# Altium schematic sheet FOC_Mode_V1.SchDoc
size A3; SheetNumber: 1; SheetTotal: 1
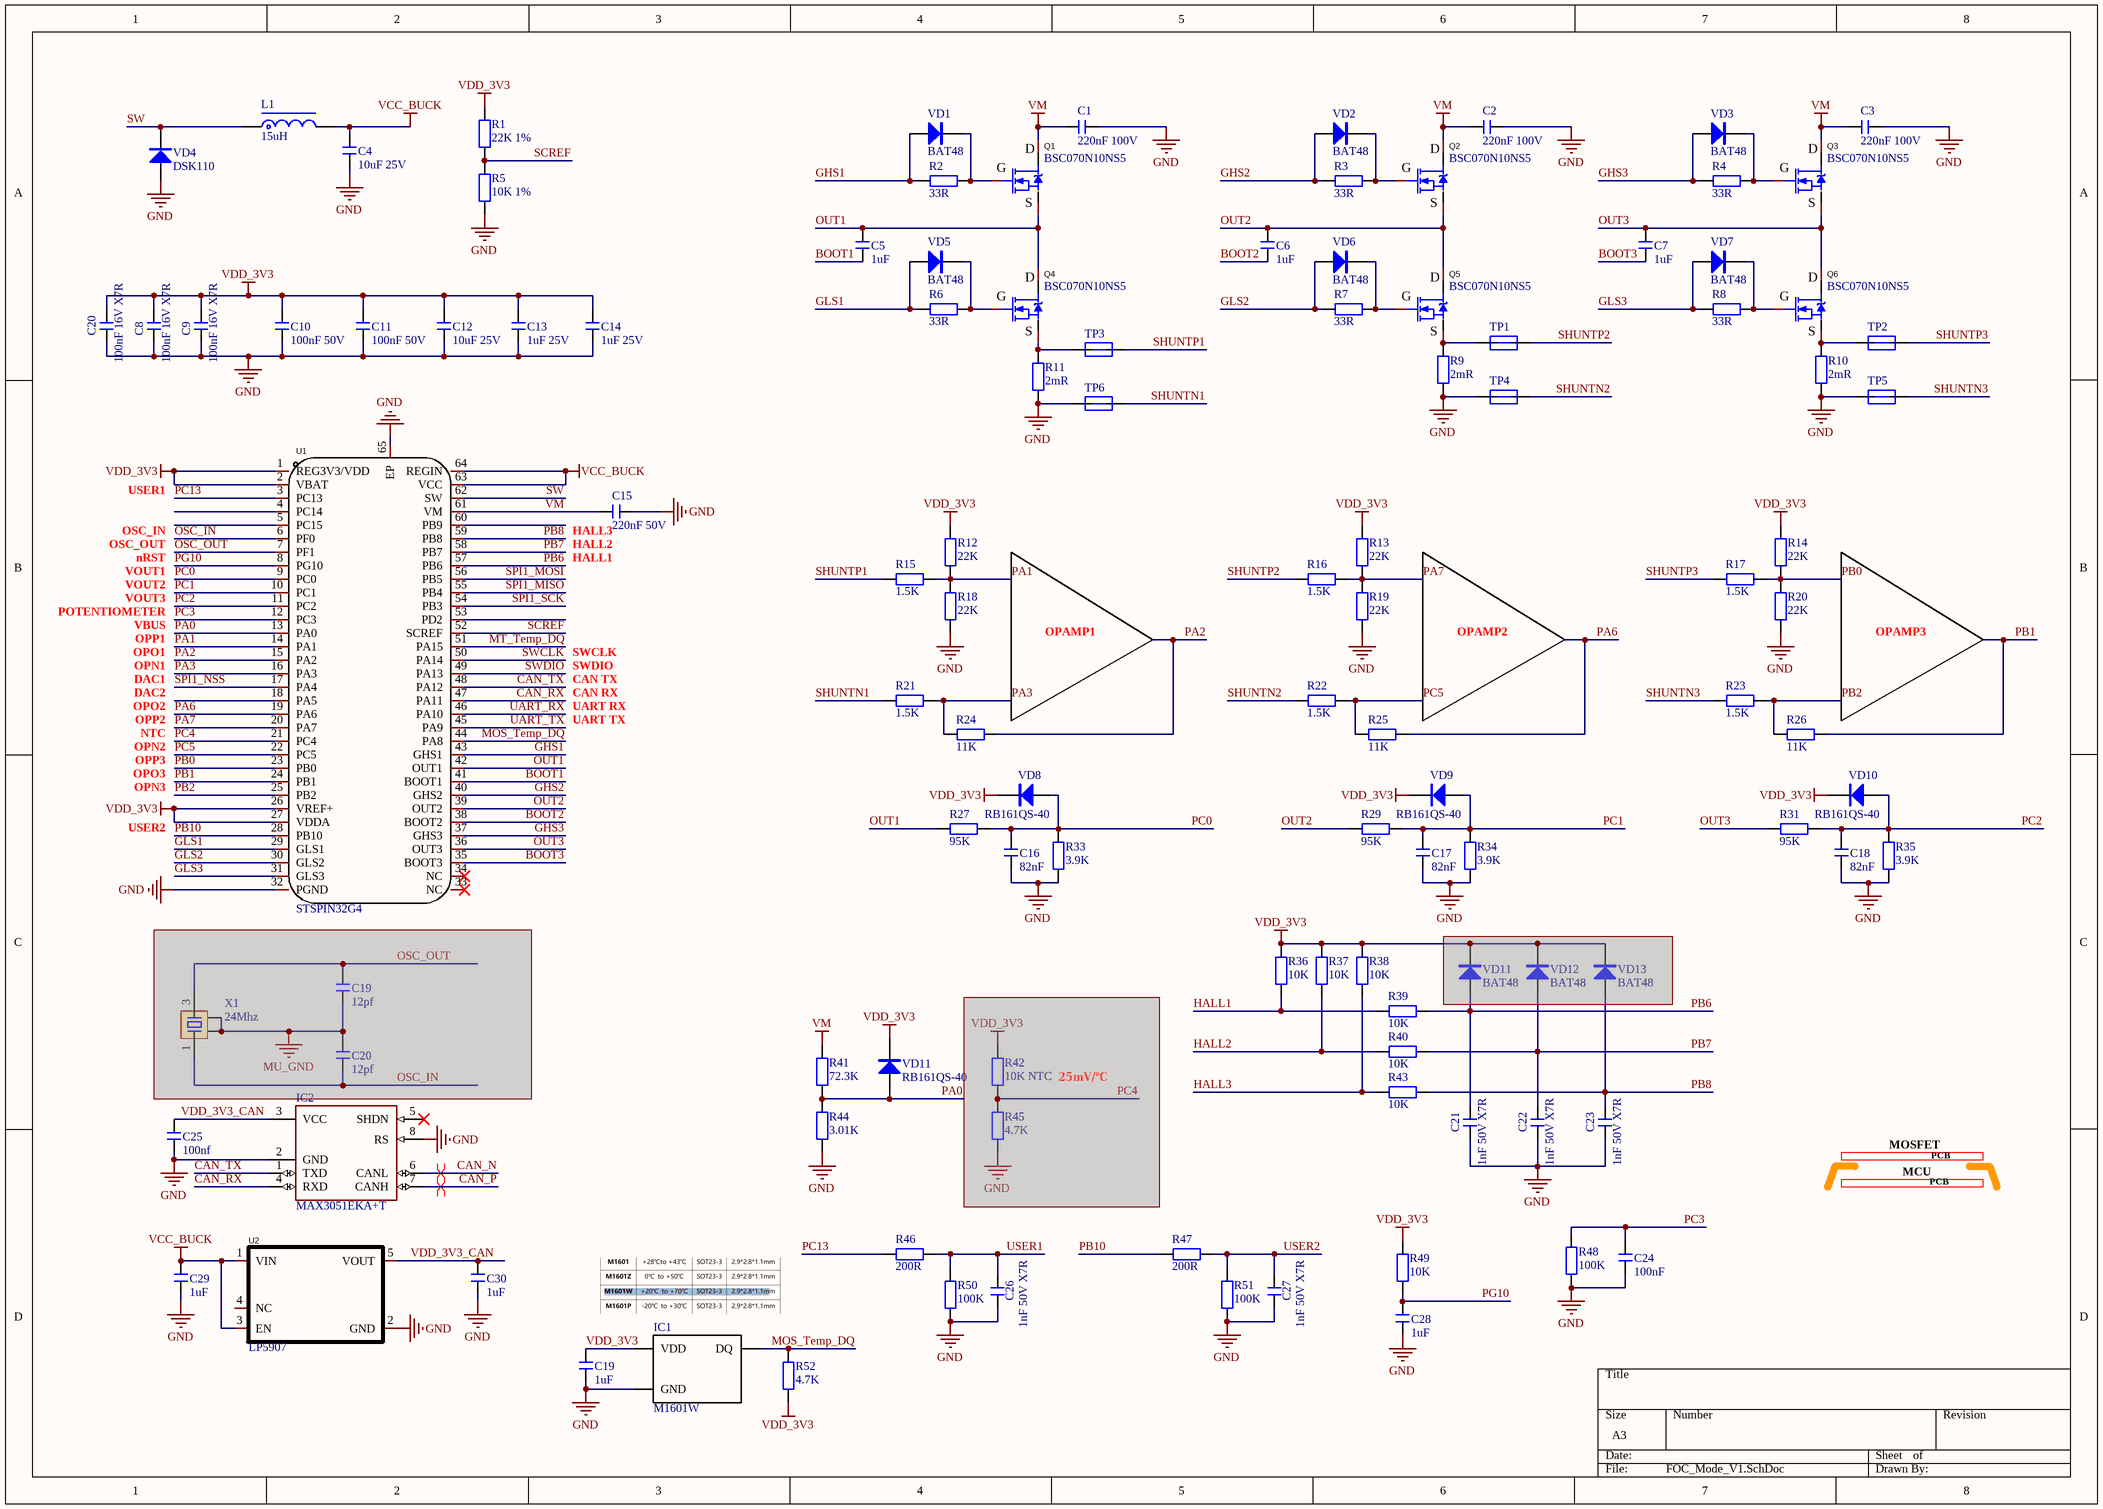
[diagram p0: FOC_Mode_V1.SchDoc]

## Parts
(Parts that share a designator on the sheet are numbered #1, #2 ... from top to bottom, then left to right.)
C1  220nF 100V  [C 0805]
C2  220nF 100V  [C 0805]
C3  220nF 100V  [C 0805]
C4  10uF 25V  [C 1206]
C5  1uF  [C 0805]
C6  1uF  [C 0805]
C7  1uF  [C 0805]
C8  100nF 16V X7R  [C 0201]
C9  100nF 16V X7R  [C 0201]
C10  100nF 50V  [C 0402]
C11  100nF 50V  [C 0402]
C12  10uF 25V  [C 0805]
C13  1uF 25V  [C 0402]
C14  1uF 25V  [C 0402]
C15  220nF 50V  [C 0603]
C16  82nF  [C 0402]
C17  82nF  [C 0402]
C18  82nF  [C 0402]
C19#1  12pf  [C 0603]  (masked out: inside a compile mask, not in the netlist)
C19#2  1uF  [C 0402]
C20#1  100nF 16V X7R  [C 0201]
C20#2  12pf  [C 0603]  (masked out: inside a compile mask, not in the netlist)
C21  1nF 50V X7R  [C 0201]
C22  1nF 50V X7R  [C 0201]
C23  1nF 50V X7R  [C 0201]
C24  100nF  [C 0402]
C25  100nf  [C 0201]
C26  1nF 50V X7R  [C 0201]
C27  1nF 50V X7R  [C 0201]
C28  1uF  [C 0402]
C29  1uF  [C 0603]
C30  1uF  [C 0603]
IC1  M1601W  [SOT23-3L]
IC2  MAX3051EKA+T  [SOT65P280X145-8N]
L1  15uH  [WHC0420(4x4x2)]
Q1  BSC070N10NS5  [INF-PG-TDSON-8-33-V]
Q2  BSC070N10NS5  [INF-PG-TDSON-8-33-V]
Q3  BSC070N10NS5  [INF-PG-TDSON-8-33-V]
Q4  BSC070N10NS5  [INF-PG-TDSON-8-33-V]
Q5  BSC070N10NS5  [INF-PG-TDSON-8-33-V]
Q6  BSC070N10NS5  [INF-PG-TDSON-8-33-V]
R1  22K 1%  [R 0201]
R2  33R  [R 0603]
R3  33R  [R 0603]
R4  33R  [R 0603]
R5  10K 1%  [R 0201]
R6  33R  [R 0603]
R7  33R  [R 0603]
R8  33R  [R 0603]
R9  2mR  [1225]
R10  2mR  [1225]
R11  2mR  [1225]
R12  22K  [R 0201]
R13  22K  [R 0201]
R14  22K  [R 0201]
R15  1.5K  [R 0201]
R16  1.5K  [R 0201]
R17  1.5K  [R 0201]
R18  22K  [R 0201]
R19  22K  [R 0201]
R20  22K  [R 0201]
R21  1.5K  [R 0201]
R22  1.5K  [R 0201]
R23  1.5K  [R 0201]
R24  11K  [R 0201]
R25  11K  [R 0201]
R26  11K  [R 0201]
R27  95K  [R 0402]
R29  95K  [R 0402]
R31  95K  [R 0402]
R33  3.9K  [R 0201]
R34  3.9K  [R 0201]
R35  3.9K  [R 0201]
R36  10K  [R 0201]
R37  10K  [R 0201]
R38  10K  [R 0201]
R39  10K  [R 0201]
R40  10K  [R 0201]
R41  72.3K  [R 0402]
R42  10K NTC  [R 0603]  (masked out: inside a compile mask, not in the netlist)
R43  10K  [R 0201]
R44  3.01K  [R 0402]
R45  4.7K  [R 0402]  (masked out: inside a compile mask, not in the netlist)
R46  200R  [R 0201]
R47  200R  [R 0201]
R48  100K  [R 0402]
R49  10K  [R 0402]
R50  100K  [R 0201]
R51  100K  [R 0201]
R52  4.7K  [R 0201]
TP1  NetTie  [Net-Tie_10mil]  (value not drawn)  (net tie, no BOM)
TP2  NetTie  [Net-Tie_10mil]  (value not drawn)  (net tie, no BOM)
TP3  NetTie  [Net-Tie_10mil]  (value not drawn)  (net tie, no BOM)
TP4  NetTie  [Net-Tie_10mil]  (value not drawn)  (net tie, no BOM)
TP5  NetTie  [Net-Tie_10mil]  (value not drawn)  (net tie, no BOM)
TP6  NetTie  [Net-Tie_10mil]  (value not drawn)  (net tie, no BOM)
U1  STSPIN32G4  [VFQFPN-64_L9.0-W9.0-P0.50-TL-EP4.0]
U2  LP5907  [SOT23-5N]
VD1  BAT48  [SOD-323]
VD2  BAT48  [SOD-323]
VD3  BAT48  [SOD-323]
VD4  DSK110  [SOD-323]
VD5  BAT48  [SOD-323]
VD6  BAT48  [SOD-323]
VD7  BAT48  [SOD-323]
VD8  RB161QS-40  [RB161QS40T18R]
VD9  RB161QS-40  [RB161QS40T18R]
VD10  RB161QS-40  [RB161QS40T18R]
VD11#1  BAT48  [SOD-323]  (masked out: inside a compile mask, not in the netlist)
VD11#2  RB161QS-40  [RB161QS40T18R]
VD12  BAT48  [SOD-323]  (masked out: inside a compile mask, not in the netlist)
VD13  BAT48  [SOD-323]  (masked out: inside a compile mask, not in the netlist)
X1  24Mhz  [XTAL-3225]  (masked out: inside a compile mask, not in the netlist)

## Nets
GND: C1.1 C2.1 C3.1 C4.1 C8.1 C9.1 C10.1 C11.1 C12.1 C13.1 C14.1 C15.1 C16.2 C17.2 C18.2 C19#2.2 C20#1.1 C21.2 C22.2 C23.2 C24.2 C25.1 C26.2 C27.2 C28.2 C29.1 C30.1 IC1.3(GND) IC2.2(GND) IC2.8(RS) R5.1 R9.1 R10.1 R11.1 R18.2 R19.2 R20.2 R33.2 R34.2 R35.2 R44.1 R48.2 R50.2 R51.2 TP4.1 TP5.1 TP6.1 U1.32(PGND) U1.65(EP) U2.2(GND) VD4.1(A)
VCC_BUCK: C4.2 C29.2 L1.2 U1.63(VCC) U1.64(REGIN) U2.1(VIN) U2.3(EN)
VDD_3V3: C8.2 C9.2 C10.2 C11.2 C12.2 C13.2 C14.2 C19#2.1 C20#1.2 IC1.1(VDD) R1.2 R12.1 R13.1 R14.1 R36.2 R37.2 R38.2 R49.1 R52.1 U1.1(REG3V3/VDD) U1.2(VBAT) U1.26(VREF+) U1.27(VDDA) VD8.2(K) VD9.2(K) VD10.2(K) VD11#2.2(K)
VM: C1.2 C2.2 C3.2 C15.2 Q1.3(D) Q2.3(D) Q3.3(D) R41.2 U1.61(VM)
BOOT1: C5.1 U1.41(BOOT1)
BOOT2: C6.1 U1.38(BOOT2)
BOOT3: C7.1 U1.35(BOOT3)
CAN_N: IC2.6(CANL)
CAN_P: IC2.7(CANH)
CAN_RX: IC2.4(RXD) U1.47(PA11)
CAN_TX: IC2.1(TXD) U1.48(PA12)
GHS1: R2.2 U1.43(GHS1) VD1.1(A)
GHS2: R3.2 U1.40(GHS2) VD2.1(A)
GHS3: R4.2 U1.37(GHS3) VD3.1(A)
GLS1: R6.2 U1.29(GLS1) VD5.1(A)
GLS2: R7.2 U1.30(GLS2) VD6.1(A)
GLS3: R8.2 U1.31(GLS3) VD7.1(A)
HALL1: R36.1 R39.1
HALL2: R37.1 R40.1
HALL3: R38.1 R43.1
MOS_Temp_DQ: IC1.2(DQ) R52.2 U1.44(PA8)
MT_Temp_DQ: U1.51(PA15)
OSC_IN: U1.6(PF0)
OSC_OUT: U1.7(PF1)
OUT1: C5.2 Q1.2(S) Q4.3(D) R27.2 U1.42(OUT1)
OUT2: C6.2 Q2.2(S) Q5.3(D) R29.2 U1.39(OUT2)
OUT3: C7.2 Q3.2(S) Q6.3(D) R31.2 U1.36(OUT3)
PA0: U1.13(PA0)
PA1: R12.2 R15.1 R18.1 U1.14(PA1)
PA2: R24.2 U1.15(PA2)
PA3: R21.1 R24.1 U1.16(PA3)
PA6: R25.2 U1.19(PA6)
PA7: R13.2 R16.1 R19.1 U1.20(PA7)
PB0: R14.2 R17.1 R20.1 U1.23(PB0)
PB1: R26.2 U1.24(PB1)
PB2: R23.1 R26.1 U1.25(PB2)
PB6: C21.1 R39.2 U1.57(PB6)
PB7: C22.1 R40.2 U1.58(PB7)
PB8: C23.1 R43.2 U1.59(PB8)
PB10: R47.2 U1.28(PB10)
PC0: C16.1 R27.1 R33.1 U1.9(PC0) VD8.1(A)
PC1: C17.1 R29.1 R34.1 U1.10(PC1) VD9.1(A)
PC2: C18.1 R31.1 R35.1 U1.11(PC2) VD10.1(A)
PC3: C24.1 R48.1 U1.12(PC3)
PC4: U1.21(PC4)
PC5: R22.1 R25.1 U1.22(PC5)
PC13: R46.2 U1.3(PC13)
PG10: C28.1 R49.2 U1.8(PG10)
SCREF: R1.1 R5.2 U1.52(SCREF)
SHUNTN1: R21.2 TP6.2
SHUNTN2: R22.2 TP4.2
SHUNTN3: R23.2 TP5.2
SHUNTP1: R15.2 TP3.2
SHUNTP2: R16.2 TP1.2
SHUNTP3: R17.2 TP2.2
SPI1_MISO: U1.55(PB4)
SPI1_MOSI: U1.56(PB5)
SPI1_NSS: U1.17(PA4)
SPI1_SCK: U1.54(PB3)
SW: L1.1 U1.62(SW) VD4.2(K)
SWCLK: U1.50(PA14)
SWDIO: U1.49(PA13)
UART_RX: U1.46(PA10)
UART_TX: U1.45(PA9)
USER1: C26.1 R46.1 R50.1
USER2: C27.1 R47.1 R51.1
VDD_3V3_CAN: C25.2 C30.2 IC2.3(VCC) U2.5(VOUT)
NetQ1_1: Q1.1(G) R2.1 VD1.2(K)
NetQ2_1: Q2.1(G) R3.1 VD2.2(K)
NetQ3_1: Q3.1(G) R4.1 VD3.2(K)
NetQ4_1: Q4.1(G) R6.1 VD5.2(K)
NetQ4_2: Q4.2(S) R11.2 TP3.1
NetQ5_1: Q5.1(G) R7.1 VD6.2(K)
NetQ5_2: Q5.2(S) R9.2 TP1.1
NetQ6_1: Q6.1(G) R8.1 VD7.2(K)
NetQ6_2: Q6.2(S) R10.2 TP2.1
NetR41_1: R41.1 R44.2 VD11#2.1(A)

Not connected (* = marked no-connect by the designer): IC2 5(SHDN)*; U1 4(PC14) 5(PC15) 18(PA5) 33(NC)* 34(NC)* 53(PD2) 60(PB9); U2 4(NC)

## Layout directives
differential pair: CAN_N, CAN_P

## Notes on the sheet
- USER1
- VOUT1
- VOUT2
- nRST
- OSC_OUT
- OSC_IN
- (near C15) HALL1
- (near C15) HALL2
- (near C15) HALL3
- OPP1
- VBUS
- VOUT3
- POTENTIOMETER
- OPAMP1
- OPAMP2
- OPAMP3
- OPP2
- OPO2
- DAC1
- DAC2
- OPN1
- OPO1
- UART TX
- UART RX
- CAN RX
- CAN TX
- SWDIO
- SWCLK
- OPO3
- OPP3
- OPN2
- NTC
- OPN3
- USER2
- 25mV/℃
- MOSFET
- MCU
- PCB

## Library data of the parts
C1-C18 C19#1 C19#2 C20#1 C20#2 C21-C30 = C: 无极性贴片电容; 版权归属: 源创客; BOM名称: 无极性贴片电容; 学习资源: www.ooocke.com
IC1 = M1601: 高精度数字模拟混合信号温度传感芯片C3010932
IC2 = MAX3051EKA: +3.3V, 1Mbps, 低电源电流 CAN 收发器 / 工作电压 3.3V / 工作电流 35mA / 工作温度 -40℃~+85℃; Manufacturer_Name: Analog Devices; Datasheet Link: https://componentsearchengine.com/Datasheets/2/MAX3051EKA+T.pdf; Height: 1.45mm; Manufacturer_Part_Number: MAX3051EKA+T; Mouser Part Number: 700-MAX3051EKAT; Mouser Price/Stock: https://www.mouser.co.uk/ProductDetail/Analog-Devices-Maxim-Integrated/MAX3051EKA%2bT?qs=7H2Jq%252ByxpJJ9A9IBkofv1A%3D%3D; Arrow Part Number: MAX3051EKA+T; Arrow Price/Stock: https://www.arrow.com/en/products/max3051ekat/analog-devices?region=europe
L1 = L-CDRH: 功率屏蔽电感; 版权归属: 源创客; BOM名称: 功率屏蔽电感; 学习资源: www.ooocke.com
Q1-Q6 = 5*6NMOS: 100V 80A N沟道; Manufacturer: Infineon(英飞凌); Add into BOM: yes; Power Dissipation (Pd): 2.5W; Drain Source On Resistance (RDS(on)@Vgs,Id): 7mΩ@10V,40A; Gate Threshold Voltage (Vgs(th)@Id): 3.8V@50uA; Name: BSC070N10NS5; Symbol: BSC070N10NS5; Device: BSC070N10NS5; LCSC Part Name: N沟道 100V 80A; Supplier Part: C534364; Manufacturer Part: BSC070N10NS5; Supplier Footprint: TDSON-8(6x5); JLCPCB Part Class: Extended Part; Datasheet: https://atta.szlcsc.com/upload/public/pdf/source/20200515/C534364_BA39A7B9D829D572459A8BCBA64659C5.pdf; Supplier: LCSC; Convert to PCB: yes; Type: N沟道; Drain Source Voltage (Vdss): 100V; Continuous Drain Current (Id): 80A
R1-R8 R12-R27 R29 R31 R33-R41 R43-R52 = R: 贴片电阻; 版权归属: 源创客; BOM名称: 贴片电阻; 学习资源: www.ooocke.com
R9-R11 = R: 采样电阻; BOM名称: 贴片电阻; 版权归属: 源创客; 学习资源: www.ooocke.com
R42 = R: 25mV/℃; BOM名称: 贴片电阻; 版权归属: 源创客; 学习资源: www.ooocke.com
TP1-TP6 = NetTie: 网络连接; BOM名称: 调试断点焊盘; 版权归属: 源创客; 学习资源: www.ooocke.com
U1 = STSPIN32G4: 高性能三相电机控制器，内置STM32G4单片机; Manufacturer: ST(意法半导体); Add into BOM: yes; Name: STSPIN32G4; Symbol: STSPIN32G4; Device: STSPIN32G4; LCSC Part Name: STSPIN32G4; Supplier Part: C2858620; Manufacturer Part: STSPIN32G4; Supplier Footprint: VFQFPN-64(9x9); JLCPCB Part Class: Extended Part; Datasheet: https://atta.szlcsc.com/upload/public/pdf/source/20221107/7278755029A6D1BE96BC9542C7938EA4.pdf; Supplier: LCSC; Convert to PCB: yes
U2 = LP5907: Fixed output options (V): / 1.2, 1.5, 1.8, 1.9, 2.2, 2.5, 2.7, 2.75, 2.8, 2.825, 2.85, 2.9, 3, 3.1, 3.2, 3.3, 3.7, 4, 4.5; Manufacturer: TECH PUBLIC(台舟); Name: TPLP5907MFX-3.3; Add into BOM: yes; Symbol: TPLP5907MFX-3.3; Device: TPLP5907MFX-3.3; LCSC Part Name: LP5907MFX-3.3; Supplier Part: C5370990; Manufacturer Part: TPLP5907MFX-3.3; Supplier Footprint: SOT-23-5; JLCPCB Part Class: Extended Part; Datasheet: https://atta.szlcsc.com/upload/public/pdf/source/20230314/FF2AD341DEE6F9B9360628D995F4E690.pdf; Supplier: LCSC; Convert to PCB: yes
VD1-VD3 VD5-VD7 = 1N4148: 肖特基二极管  C2919747; BOM名称: 高速开关二极管; 版权归属: 源创客; 学习资源: www.ooocke.com
VD4 = 1N4148: 肖特基二极管 C727071; BOM名称: 高速开关二极管; 版权归属: 源创客; 学习资源: www.ooocke.com
VD8-VD10 VD11#2 = Schottky: 肖特基二极管; 版权归属: 源创客; 属性: 40V/1A; BOM名称: 肖特基二极管; 学习资源: www.ooocke.com
VD11#1 VD12 VD13 = 1N4148: 肖特基二极管; BOM名称: 高速开关二极管; 版权归属: 源创客; 学习资源: www.ooocke.com
X1 = XTAL-4: 3225晶振; BOM名称: 4脚晶振; 版权归属: 源创客; 学习资源: www.ooocke.com